# Altium schematic sheet display.SchDoc
size A4; DrawnBy: Benjie Van Limbergen; Revision: 1.0; SheetNumber: 2; SheetTotal: 4
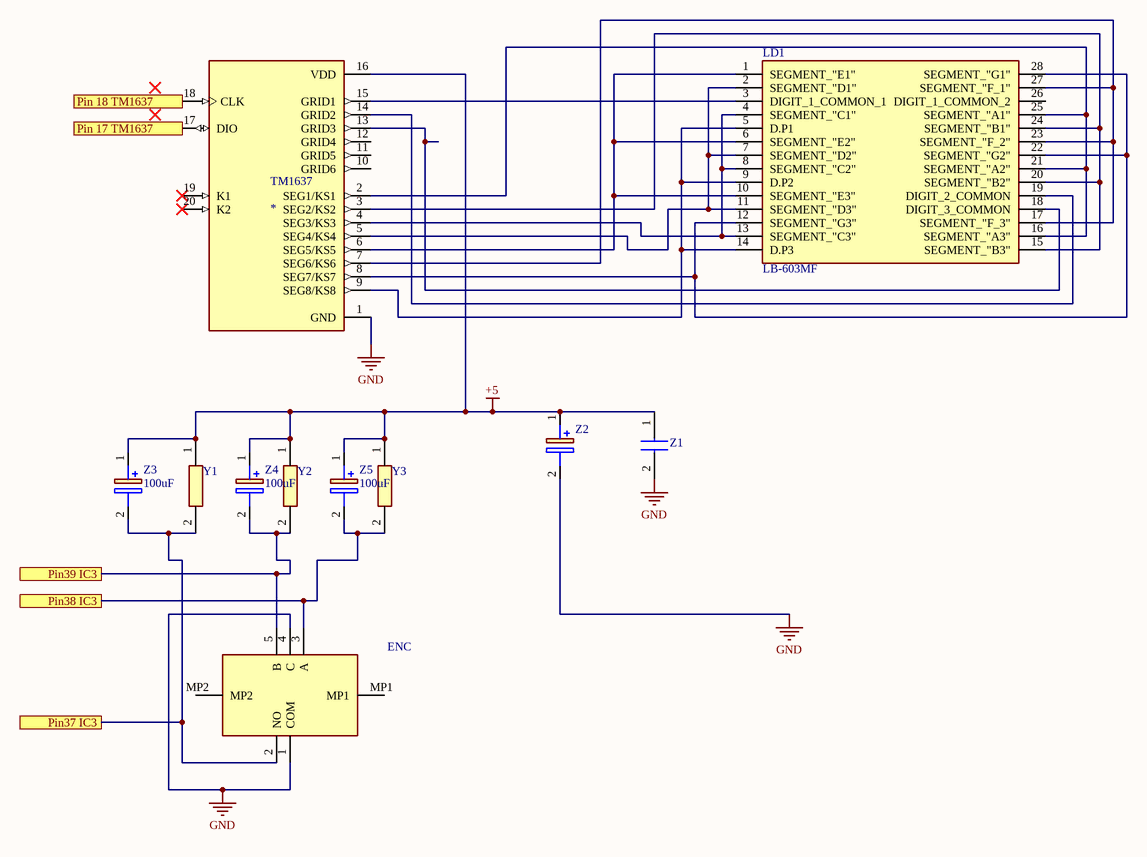
[diagram p0: display.SchDoc]

## Parts
ENC  482016514001  [482016514001]  (value not drawn)
LD1  LB-603MF  [DIP1524W50P254L3750H820Q28N]
TM1637  *  [DIP778W43P254L2612H431Q20N]
Y1  ESR10EZPJ183  [RESC2012X60N]  (value not drawn)
Y2  ESR10EZPJ183  [RESC2012X60N]  (value not drawn)
Y3  ESR10EZPJ183  [RESC2012X60N]  (value not drawn)
Z1  860010683032  [CAPPRD200W55D500H1200]  (value not drawn)
Z2  860240672002  [CAPC2012X90N]  (value not drawn)
Z3  100uF  [CAPC2012X90N]
Z4  100uF  [CAPC2012X90N]
Z5  100uF  [CAPC2012X90N]

## Ports
Pin37 IC3, Pin38 IC3, Pin39 IC3, Pin 17 TM1637, Pin 18 TM1637

## Nets
+5: TM1637.16(VDD) Y1.1 Y2.1 Y3.1 Z1.1(+) Z2.1(+) Z3.1(+) Z4.1(+) Z5.1(+)
GND: ENC.1(COM) ENC.4(C) TM1637.1(GND) Z1.2(-) Z2.2(-)
Pin37 IC3: ENC.2(NO) Y1.2 Z3.2(-) ; port Pin37 IC3
Pin38 IC3: ENC.3(A) Y3.2 Z5.2(-) ; port Pin38 IC3
Pin39 IC3: ENC.5(B) Y2.2 Z4.2(-) ; port Pin39 IC3
Pin 17 TM1637: TM1637.17(DIO) ; port Pin 17 TM1637
Pin 18 TM1637: TM1637.18(CLK) ; port Pin 18 TM1637
NetLD1_1: LD1.1(SEGMENT_"E1") LD1.6(SEGMENT_"E2") LD1.10(SEGMENT_"E3") TM1637.6(SEG5/KS5)
NetLD1_2: LD1.2(SEGMENT_"D1") LD1.7(SEGMENT_"D2") LD1.11(SEGMENT_"D3") TM1637.5(SEG4/KS4)
NetLD1_3: LD1.3(DIGIT_1_COMMON_1) TM1637.15(GRID1)
NetLD1_4: LD1.4(SEGMENT_"C1") LD1.8(SEGMENT_"C2") LD1.13(SEGMENT_"C3") TM1637.4(SEG3/KS3)
NetLD1_5: LD1.5(D.P1) LD1.9(D.P2) LD1.14(D.P3) TM1637.9(SEG8/KS8)
NetLD1_12: LD1.12(SEGMENT_"G3") LD1.22(SEGMENT_"G2") LD1.28(SEGMENT_"G1") TM1637.8(SEG7/KS7)
NetLD1_15: LD1.15(SEGMENT_"B3") LD1.20(SEGMENT_"B2") LD1.24(SEGMENT_"B1") TM1637.3(SEG2/KS2)
NetLD1_16: LD1.16(SEGMENT_"A3") LD1.21(SEGMENT_"A2") LD1.25(SEGMENT_"A1") TM1637.2(SEG1/KS1)
NetLD1_17: LD1.17(SEGMENT_"F_3") LD1.23(SEGMENT_"F_2") LD1.27(SEGMENT_"F_1") TM1637.7(SEG6/KS6)
NetLD1_18: LD1.18(DIGIT_3_COMMON) TM1637.13(GRID3)
NetLD1_19: LD1.19(DIGIT_2_COMMON) TM1637.14(GRID2)

Not connected (* = marked no-connect by the designer): ENC MP1 MP2; LD1 26(DIGIT_1_COMMON_2); TM1637 10(GRID6) 11(GRID5) 12(GRID4) 19(K1)* 20(K2)*

## Library data of the parts
ENC = 482016514001: Switch; Manufacturer_Name: Wurth Elektronik; Datasheet Link: https://componentsearchengine.com//482016514001.pdf; Height: 26.9mm; Mouser2 Part Number: 710-482016514001; Mouser2 Price/Stock: https://www.mouser.com/Search/Refine.aspx?Keyword=710-482016514001; Manufacturer_Part_Number: 482016514001
LD1 = LB-603MF: Display; Manufacturer_Name: ROHM Semiconductor; Datasheet Link: https://datasheet.datasheetarchive.com/originals/distributors/Datasheets_SAMA/27b839e3b28040d1ff79b0bfb62b7eff.pdf; Height: 8.2mm; Manufacturer_Part_Number: LB-603MF
TM1637 = TM1637: LED Drive Control Special Circuit; MF: Titan Micro Electronics; Package: Package; Availability: Not in stock; SnapEDA_Link: https://www.snapeda.com/parts/TM1637/Titan+Micro+Electronics/view-part/?ref=snap; MP: TM1637; Check_prices: https://www.snapeda.com/parts/TM1637/Titan+Micro+Electronics/view-part/?ref=eda; Value: *; Price: None
Y1-Y3 = ESR10EZPJ183: Resistor SMD 0805 10k; Manufacturer_Name: ROHM Semiconductor; Datasheet Link: https://datasheet.datasheetarchive.com/originals/distributors/Datasheets_SAMA/30ccb516c688c96e56c83a00b77a93f4.pdf; Height: 0.65mm; Manufacturer_Part_Number: ESR10EZPJ183
Z1 = 860010683032: Capacitor C1; Manufacturer_Name: Wurth Elektronik; Datasheet Link: https://componentsearchengine.com/Datasheets/2/860010683032.pdf; Height: 41mm; Manufacturer_Part_Number: 860010683032
Z2 = 860240672002: Capacitor Polarised; Manufacturer_Name: Wurth Elektronik; Datasheet Link: https://katalog.we-online.de/pbs/datasheet/860240672002.pdf; Height: 12.5mm; Manufacturer_Part_Number: 860240672002
Z3-Z5 = ECA-1HHG2R2B: Capacitor Polarised C4 3,5mm 8x11mm; Manufacturer_Name: Panasonic; Datasheet Link: http://industrial.panasonic.com/cdbs/www-data/pdf/RDF0000/ABA0000C1215.pdf; Height: 12mm; Manufacturer_Part_Number: ECA-1HHG2R2B